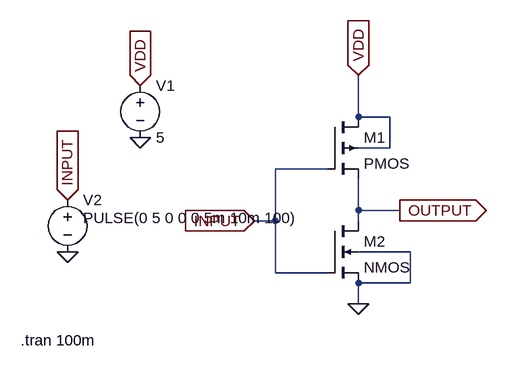
[diagram p0: schematic CMOSINVERTER_Transient.asc]
CMOSINVERTER_Transient.asc, the LTspice schematic file:
Version 4
SHEET 1 880 680
WIRE 368 80 368 16
WIRE 416 80 368 80
WIRE 416 128 416 80
WIRE 416 128 368 128
WIRE 320 160 240 160
WIRE 368 224 368 176
WIRE 432 224 368 224
WIRE 240 240 240 160
WIRE 240 240 208 240
WIRE 368 240 368 224
WIRE 448 288 368 288
WIRE 240 320 240 240
WIRE 320 320 240 320
WIRE 448 336 448 288
WIRE 448 336 368 336
WIRE 368 368 368 336
FLAG 368 368 0
FLAG 208 240 INPUT
IOPIN 208 240 In
FLAG 432 224 OUTPUT
IOPIN 432 224 Out
FLAG 368 16 VDD
IOPIN 368 16 In
FLAG -80 288 0
FLAG 32 112 0
FLAG 32 32 VDD
IOPIN 32 32 In
FLAG -80 208 INPUT
IOPIN -80 208 In
SYMBOL pmos4 320 80 R0
SYMATTR InstName M1
SYMBOL nmos4 320 240 R0
SYMATTR InstName M2
SYMBOL voltage 32 16 R0
WINDOW 123 0 0 Left 0
WINDOW 39 0 0 Left 0
SYMATTR InstName V1
SYMATTR Value 5
SYMBOL voltage -80 192 R0
WINDOW 123 0 0 Left 0
WINDOW 39 0 0 Left 0
WINDOW 3 24 44 Left 2
SYMATTR Value PULSE(0 5 0 0 0 5m 10m 100)
SYMATTR InstName V2
TEXT -152 424 Left 2 !.tran 100m

The netlist it stands for:
* CMOSINVERTER_Transient.asc
M1 VDD INPUT OUTPUT VDD PMOS
M2 OUTPUT INPUT 0 0 NMOS
V1 VDD 0 5
V2 INPUT 0 PULSE(0 5 0 0 0 5m 10m 100)
.model NMOS NMOS
.model PMOS PMOS
.lib standard.mos
.tran 100m
.backanno
.end

* Results of the author's LTspice run, read from the files saved beside the schematic
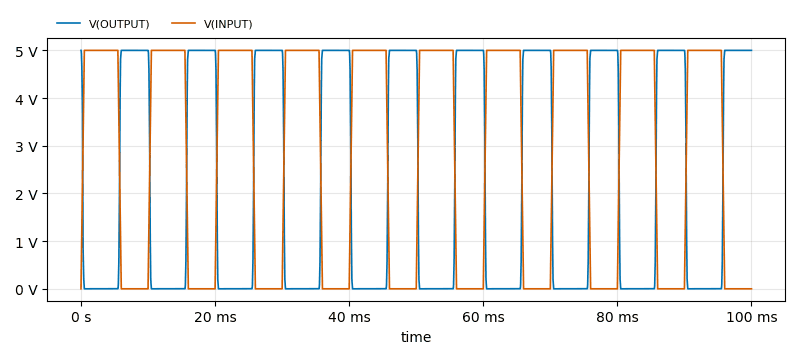
[diagram p1: Transient Analysis of CMOSINVERTER_Transient.asc, plotted from the saved traces]
* Transient Analysis, 1 run:
*   V(OUTPUT): min 0 V, max 5 V, average 2.25 V, rms 3.319 V, last 5 V
*   V(INPUT): min 0 V, max 5 V, average 2.75 V, rms 3.653 V, last 0 V